# Altium project Memory Address Decoder.PrjPcb
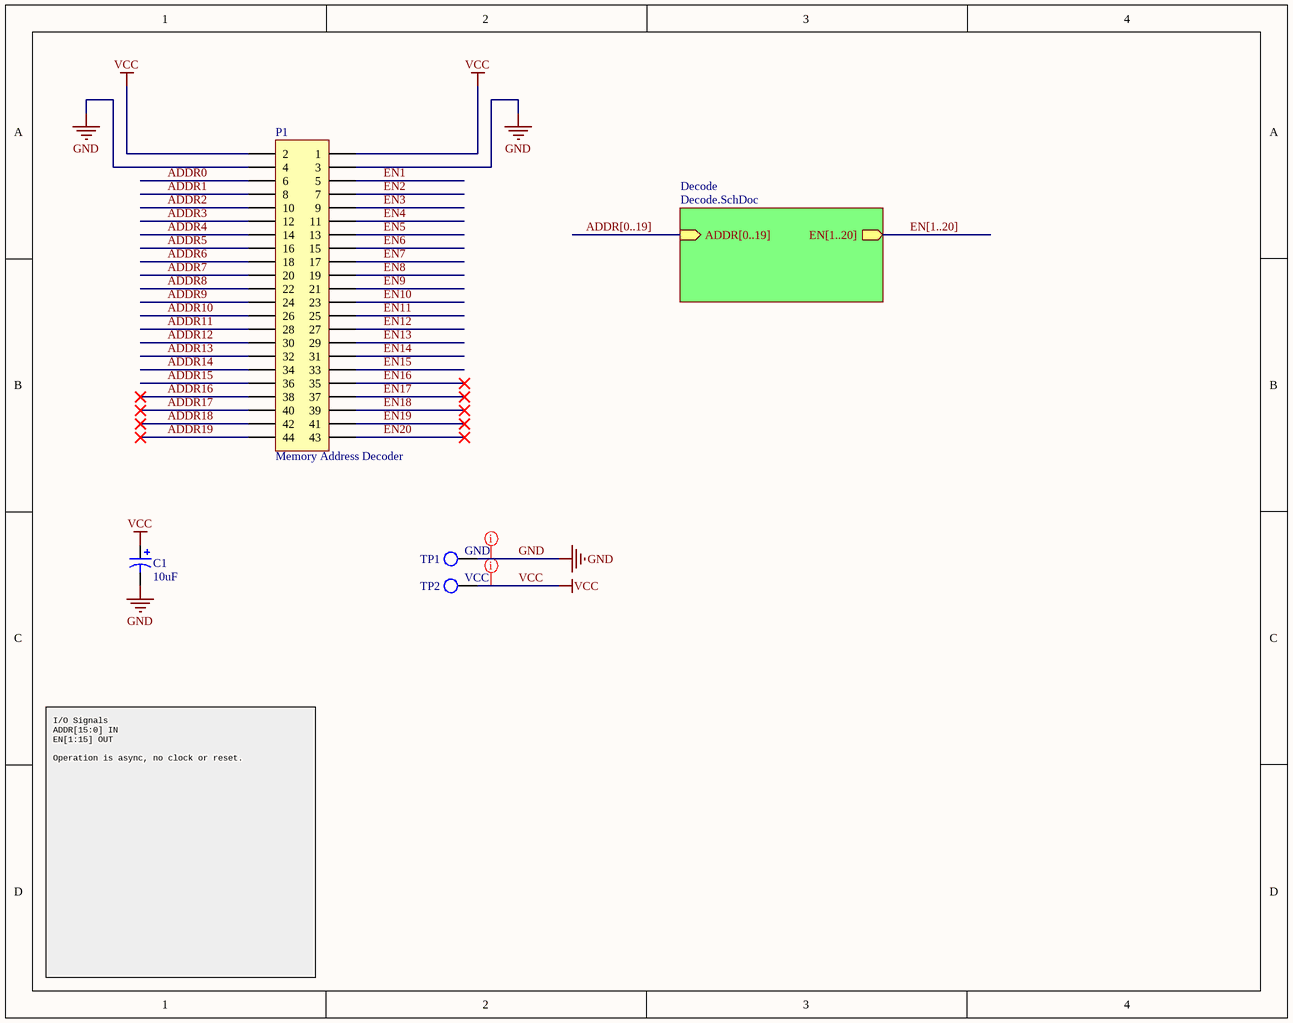
[diagram p0: Top.SchDoc]
2 sheets, 21 parts. Net scope: hierarchical (ports join the sheet entries above them; power ports are global).
Board file: Memory Address Decoder.PcbDoc
Sheets:
  Top.SchDoc
    Decode = Decode.SchDoc

## Sheet Top.SchDoc
size A; Author: E. Sims; Organization: Let's Build Rockets Inc.; SheetNumber: 1; SheetTotal: 2

### Parts
C1  value 10uF  [C5x7]  (hidden comment: Cap Pol5)
P1  Memory Address Decoder  [HDR2X22H]
TP1  GND  [KSTN-5011_V]  (no BOM)
TP2  VCC  [KSTN-5011_V]  (no BOM)

### Sub-sheets
Decode = Decode.SchDoc: EN[1..20] (out), ADDR[0..19] (in)

### Nets
GND: C1.2 P1.3 P1.4 TP1.1
VCC: C1.1 P1.1 P1.2 TP2.1
ADDR0: P1.6
ADDR1: P1.8
ADDR2: P1.10
ADDR3: P1.12
ADDR4: P1.14
ADDR5: P1.16
ADDR6: P1.18
ADDR7: P1.20
ADDR8: P1.22
ADDR9: P1.24
ADDR10: P1.26
ADDR11: P1.28
ADDR12: P1.30
ADDR13: P1.32
ADDR14: P1.34
ADDR15: P1.36
ADDR16: P1.38
ADDR17: P1.40
ADDR18: P1.42
ADDR19: P1.44
EN1: P1.5
EN2: P1.7
EN3: P1.9
EN4: P1.11
EN5: P1.13
EN6: P1.15
EN7: P1.17
EN8: P1.19
EN9: P1.21
EN10: P1.23
EN11: P1.25
EN12: P1.27
EN13: P1.29
EN14: P1.31
EN15: P1.33
EN16: P1.35
EN17: P1.37
EN18: P1.39
EN19: P1.41
EN20: P1.43

### Buses and harness runs
bus ADDR[0..19] = sheet Decode/ADDR[0..19]
bus EN[1..20] = sheet Decode/EN[1..20]

### Layout directives
rule Width Constraint [Pref Width = 20mil    Min Width = 20mil    Max Width = 50mil]; rule Routing Via Style [Pref Size = 35mil    Pref Hole Size = 20mil]; net class PWR: GND, VCC

### Notes on the sheet
- I/O Signals
  ADDR[15:0] IN
  EN[1:15] OUT
  Operation is async, no clock or reset.
- Let's Build Rocket's Inc. Modular Paylaod System Based on TMP-010 Rev
  For more information visit https://github.com/LetsBuildRockets/Modular-Payload-System
  This work is licensed under CC BY-NC 4.0. To view a copy of this license, visit https://creativecommons.org/licenses/by-nc/4.0
- Title
- Size:
- Date:
- Assembly Variant:
- B
- Number:
- Time:
- Revision:
- Sheet
- of
- Author:
- File:

### Library data of the parts
C1 = Cap Pol5: Polarized Capacitor; Published: 8-Jun-2000; LatestRevisionDate: 17-Jul-2002; LatestRevisionNote: Re-released for DXP Platform.; PackageReference: POLAR0.8; Publisher: Altium Limited; PackageDescription: Polarized Capacitor; 2 Leads
P1 = Header 22X2H: Header, 22-Pin, Dual row, Right Angle; System: Connector; LatestRevisionDate: 17-Jul-2002; LatestRevisionNote: Re-released for DXP Platform.; Publisher: Altium Limited
TP1 TP2 = TP

## Sheet Decode.SchDoc
size B; Author: E. Sims; Organization: Let's Build Rockets Inc.; SheetNumber: 2; SheetTotal: 2
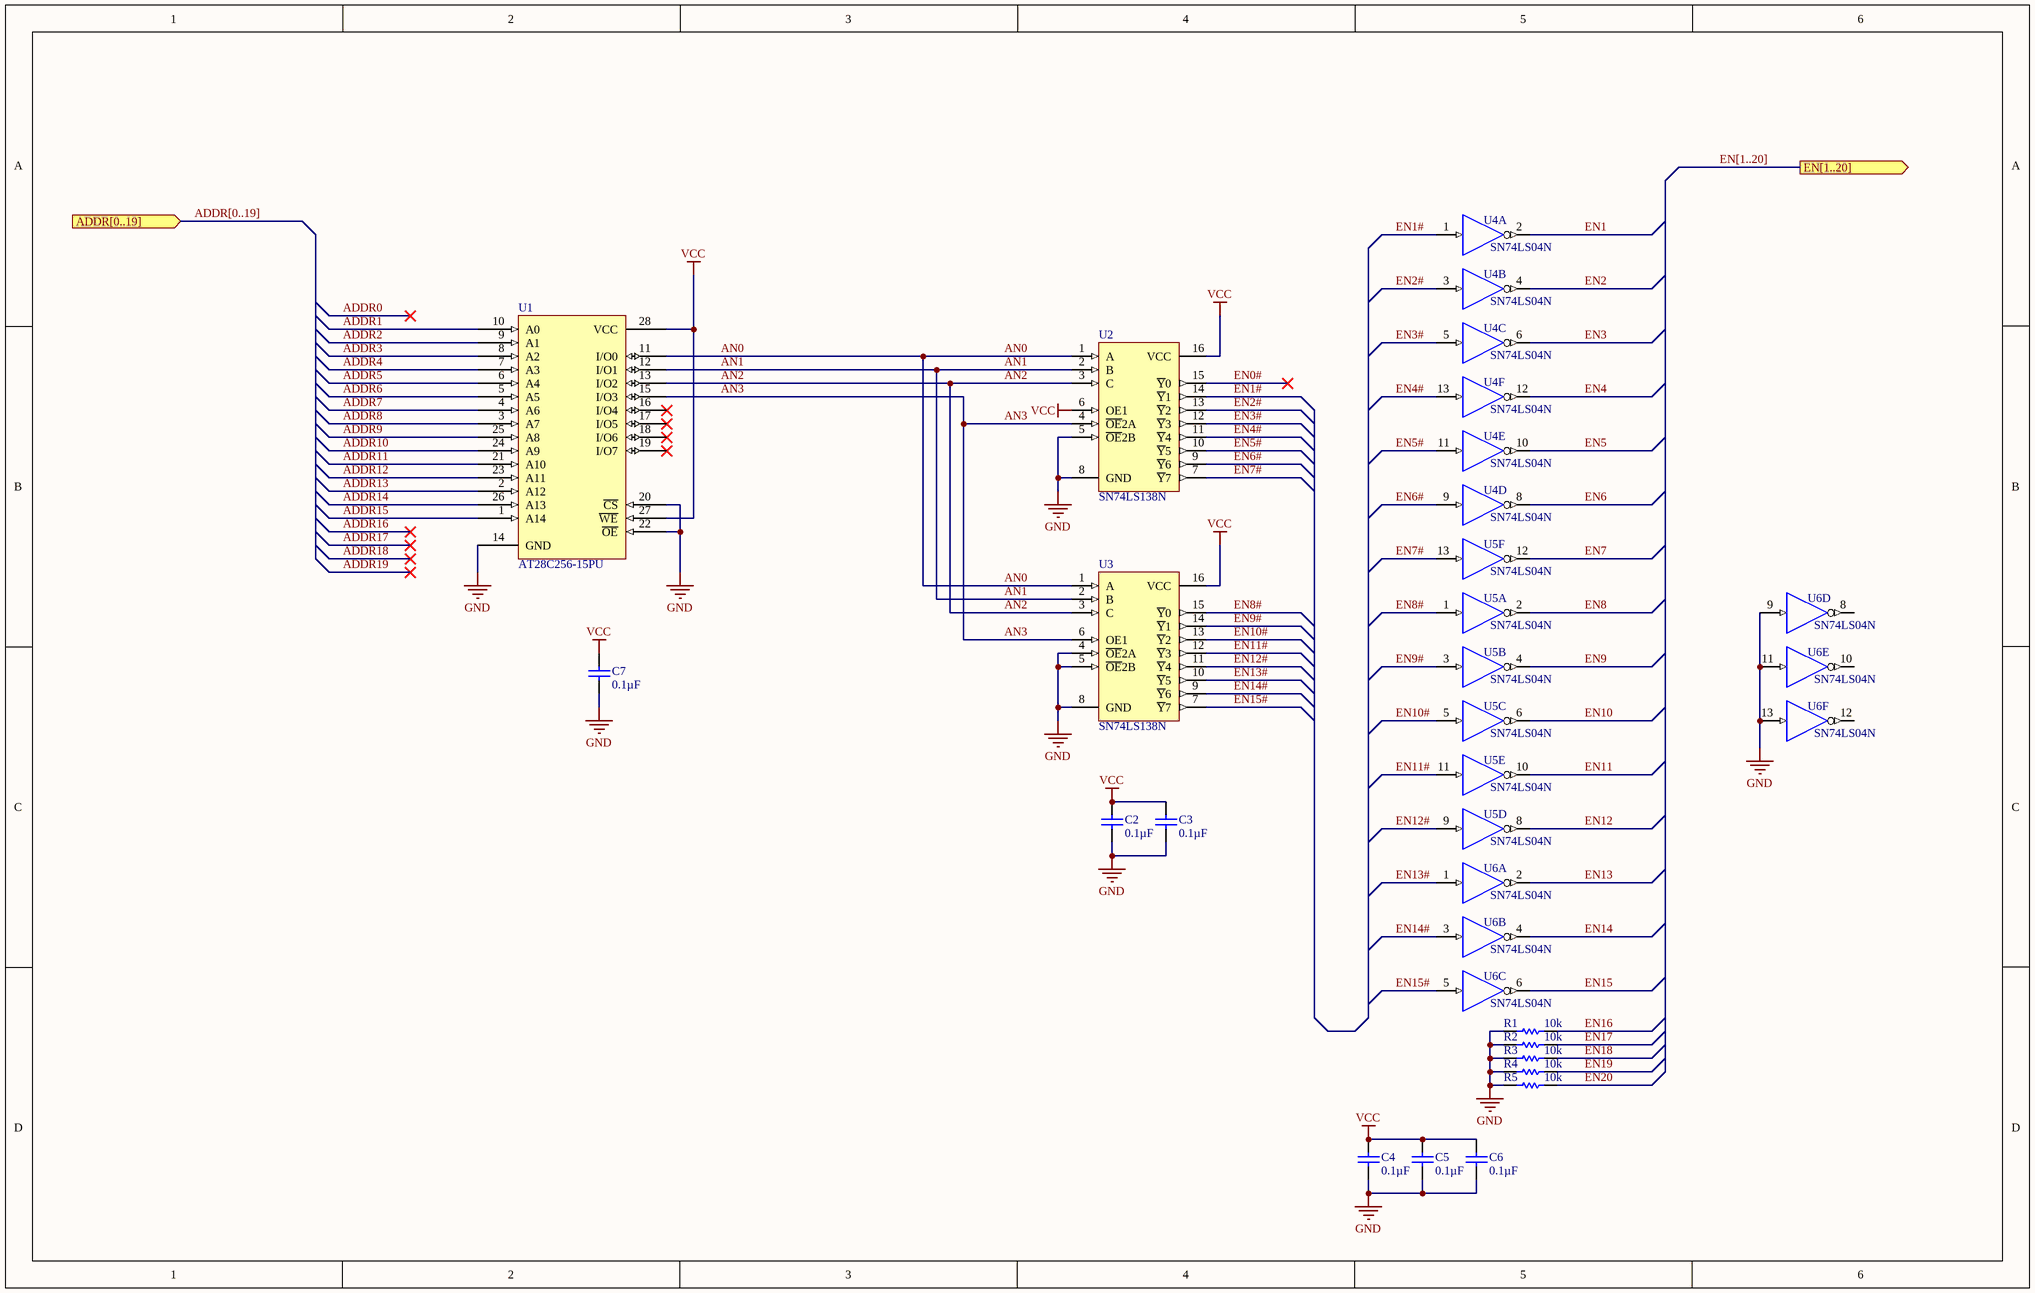
[diagram p1: Decode.SchDoc]

### Parts
C2  Capacitance: 0.1µF  [VISH-K104K15X7RF5TL2]  (hidden comment: K104K15X7RF5TL2)
C3  Capacitance: 0.1µF  [VISH-K104K15X7RF5TL2]  (hidden comment: K104K15X7RF5TL2)
C4  Capacitance: 0.1µF  [VISH-K104K15X7RF5TL2]  (hidden comment: K104K15X7RF5TL2)
C5  Capacitance: 0.1µF  [VISH-K104K15X7RF5TL2]  (hidden comment: K104K15X7RF5TL2)
C6  Capacitance: 0.1µF  [VISH-K104K15X7RF5TL2]  (hidden comment: K104K15X7RF5TL2)
C7  Capacitance: 0.1µF  [VISH-K104K15X7RF5TL2]  (hidden comment: K104K15X7RF5TL2)
R1  value 10k  [AXIAL-0.3]  (hidden comment: Res1)
R2  value 10k  [AXIAL-0.3]  (hidden comment: Res1)
R3  value 10k  [AXIAL-0.3]  (hidden comment: Res1)
R4  value 10k  [AXIAL-0.3]  (hidden comment: Res1)
R5  value 10k  [AXIAL-0.3]  (hidden comment: Res1)
U1  AT28C256-15PU  [J028]
U2  SN74LS138N  [N016]
U3  SN74LS138N  [N016]
U4  SN74LS04N  [N014]  (parts A,B,C,D,E,F of 6)
U5  SN74LS04N  [N014]  (parts A,B,C,D,E,F of 6)
U6  SN74LS04N  [N014]  (parts A,B,C,D,E,F of 6)

### Ports
ADDR[0..19] (in), EN[1..20] (out)

### Nets
GND: C2.2 C3.2 C4.2 C5.2 C6.2 C7.2 R1.1 R2.1 R3.1 R4.1 R5.1 U1.14(GND) U1.20(~{CS}) U1.22(~{OE}) U2.5(~{OE}2B) U2.8(GND) U3.4(~{OE}2A) U3.5(~{OE}2B) U3.8(GND) U4.7(GND) U5.7(GND) U6.7(GND) U6.9(A) U6.11(A) U6.13(A)
VCC: C2.1 C3.1 C4.1 C5.1 C6.1 C7.1 U1.27(~{WE}) U1.28(VCC) U2.6(OE1) U2.16(VCC) U3.16(VCC) U4.14(VCC) U5.14(VCC) U6.14(VCC)
ADDR1: U1.10(A0)
ADDR2: U1.9(A1)
ADDR3: U1.8(A2)
ADDR4: U1.7(A3)
ADDR5: U1.6(A4)
ADDR6: U1.5(A5)
ADDR7: U1.4(A6)
ADDR8: U1.3(A7)
ADDR9: U1.25(A8)
ADDR10: U1.24(A9)
ADDR11: U1.21(A10)
ADDR12: U1.23(A11)
ADDR13: U1.2(A12)
ADDR14: U1.26(A13)
ADDR15: U1.1(A14)
AN0: U1.11(I/O0) U2.1(A) U3.1(A)
AN1: U1.12(I/O1) U2.2(B) U3.2(B)
AN2: U1.13(I/O2) U2.3(C) U3.3(C)
AN3: U1.15(I/O3) U2.4(~{OE}2A) U3.6(OE1)
EN0#: U2.15(~{Y}0)
EN1: U4.2(Y)
EN1#: U2.14(~{Y}1) U4.1(A)
EN2: U4.4(Y)
EN2#: U2.13(~{Y}2) U4.3(A)
EN3: U4.6(Y)
EN3#: U2.12(~{Y}3) U4.5(A)
EN4: U4.12(Y)
EN4#: U2.11(~{Y}4) U4.13(A)
EN5: U4.10(Y)
EN5#: U2.10(~{Y}5) U4.11(A)
EN6: U4.8(Y)
EN6#: U2.9(~{Y}6) U4.9(A)
EN7: U5.12(Y)
EN7#: U2.7(~{Y}7) U5.13(A)
EN8: U5.2(Y)
EN8#: U3.15(~{Y}0) U5.1(A)
EN9: U5.4(Y)
EN9#: U3.14(~{Y}1) U5.3(A)
EN10: U5.6(Y)
EN10#: U3.13(~{Y}2) U5.5(A)
EN11: U5.10(Y)
EN11#: U3.12(~{Y}3) U5.11(A)
EN12: U5.8(Y)
EN12#: U3.11(~{Y}4) U5.9(A)
EN13: U6.2(Y)
EN13#: U3.10(~{Y}5) U6.1(A)
EN14: U6.4(Y)
EN14#: U3.9(~{Y}6) U6.3(A)
EN15: U6.6(Y)
EN15#: U3.7(~{Y}7) U6.5(A)
EN16: R1.2
EN17: R2.2
EN18: R3.2
EN19: R4.2
EN20: R5.2

Not connected (* = marked no-connect by the designer): U1 16(I/O4)* 17(I/O5)* 18(I/O6)* 19(I/O7)*; U6 8(Y) 10(Y) 12(Y)

### Buses and harness runs
bus ADDR[0..19] = port ADDR[0..19]
bus EN[1..20] = port EN[1..20]

### Notes on the sheet
- Let's Build Rocket's Inc. Modular Paylaod System Based on TMP-010 Rev
  For more information visit https://github.com/LetsBuildRockets/Modular-Payload-System
  This work is licensed under CC BY-NC 4.0. To view a copy of this license, visit https://creativecommons.org/licenses/by-nc/4.0
- Title
- Size:
- Date:
- Assembly Variant:
- B
- Number:
- Time:
- Revision:
- Sheet
- of
- Author:
- File:

### Library data of the parts
C2-C7 = CMP-2000-06508-1: Ceramic Capacitor, 100 nF, +/- 10%, 50 V, -55 to 125 degC, 2-Pin THD, RoHS, Tape and Reel; Manufacturer: Vishay; Other Names: BC1084CT; Catalog Drawings: Mono-KapSide2-15_5.58Mono-KapSide1_15; Temperature Coefficient: X7R; Voltage - Rated: 50V; Online Catalog: Mono-Kap™Series; Size / Dimension: 0.157"Lx0.098"W(4.00mmx2.50mm); Operating Temperature: -55°C~125°C; Family: CeramicCapacitors; Manufacturer URL: http://www.vishay.com/; Standard Package: 1; Thickness (Max): -; Ratings: -; Datasheet Version: 08/2013; Package Description: 2-Pin Through Hole Device, Body 4 x 2.6 mm; Mounting Type: ThroughHole; Features: -; Lead Spacing: 0.098"(2.50mm); Tolerance: ±10%; Category: Capacitors; Mounting Technology: ThroughHole; Lead Style: Straight; Datasheet URL: http://www.vishay.com/docs/45171/kseries.pdf; Applications: GeneralPurpose; Package / Case: Radial; Height - Seated (Max): 0.220"(5.58mm); Package Reference: K104K15X7RF5TL2; Series: Mono-Kap™K; Packaging: CutTape(CT)
R1-R5 = Res1: Resistor; Published: 8-Jun-2000; LatestRevisionDate: 17-Jul-2002; LatestRevisionNote: Re-released for DXP Platform.; PackageReference: AXIAL-0.3; Publisher: Altium Limited; PackageDescription: Axial Device, Thru-Hole; 2 Leads; 0.3 in Pin Spacing
U2 U3 = SN74LS138N: 3-Line to 8-Line Decoder / Demultiplexer; Published: 8-Jun-2000; LatestRevisionDate: 04-Mar-2005; LatestRevisionNote: Stylized 3D Model Added.; DatasheetVersion: Mar-1988; PackageVersion: Oct-1995; PackageReference: N016; Publisher: Altium Limited; PackageDescription: DIP; 16 Leads; Row Spacing 7.62 mm; Pitch 2.54 mm; ComponentLink1Description: Manufacturer Link; ComponentLink1URL: http://www.ti.com/; ComponentLink2Description: Datasheet; ComponentLink2URL: http://www-s.ti.com/sc/ds/sn74ls138.pdf; Code_JEDEC: MS-001-BB
U4-U6 = SN74LS04N: Hex Inverter; Published: 8-Jun-2000; LatestRevisionDate: 04-Mar-2005; LatestRevisionNote: Stylized 3D Model Added.; DatasheetVersion: Mar-1988; PackageVersion: Oct-1995; PackageReference: N014; Publisher: Altium Limited; PackageDescription: DIP; 14 Leads; Row Spacing 7.62 mm; Pitch 2.54 mm; ComponentLink1Description: Manufacturer Link; ComponentLink1URL: http://www.ti.com/; ComponentLink2Description: Datasheet; ComponentLink2URL: http://www-s.ti.com/sc/ds/sn74ls04.pdf

## Nets that join several sheets
GND: Top (C1.2 P1.3 P1.4 TP1.1), Decode (25 pins)
VCC: Top (C1.1 P1.1 P1.2 TP2.1), Decode (14 pins)
ADDR1: Top (P1.8), Decode (U1.10)
ADDR2: Top (P1.10), Decode (U1.9)
ADDR3: Top (P1.12), Decode (U1.8)
ADDR4: Top (P1.14), Decode (U1.7)
ADDR5: Top (P1.16), Decode (U1.6)
ADDR6: Top (P1.18), Decode (U1.5)
ADDR7: Top (P1.20), Decode (U1.4)
ADDR8: Top (P1.22), Decode (U1.3)
ADDR9: Top (P1.24), Decode (U1.25)
ADDR10: Top (P1.26), Decode (U1.24)
ADDR11: Top (P1.28), Decode (U1.21)
ADDR12: Top (P1.30), Decode (U1.23)
ADDR13: Top (P1.32), Decode (U1.2)
ADDR14: Top (P1.34), Decode (U1.26)
ADDR15: Top (P1.36), Decode (U1.1)
EN1: Top (P1.5), Decode (U4.2)
EN2: Top (P1.7), Decode (U4.4)
EN3: Top (P1.9), Decode (U4.6)
EN4: Top (P1.11), Decode (U4.12)
EN5: Top (P1.13), Decode (U4.10)
EN6: Top (P1.15), Decode (U4.8)
EN7: Top (P1.17), Decode (U5.12)
EN8: Top (P1.19), Decode (U5.2)
EN9: Top (P1.21), Decode (U5.4)
EN10: Top (P1.23), Decode (U5.6)
EN11: Top (P1.25), Decode (U5.10)
EN12: Top (P1.27), Decode (U5.8)
EN13: Top (P1.29), Decode (U6.2)
EN14: Top (P1.31), Decode (U6.4)
EN15: Top (P1.33), Decode (U6.6)
EN16: Top (P1.35), Decode (R1.2)
EN17: Top (P1.37), Decode (R2.2)
EN18: Top (P1.39), Decode (R3.2)
EN19: Top (P1.41), Decode (R4.2)
EN20: Top (P1.43), Decode (R5.2)